# EAGLE design rs323-ttl-hack (EAGLE 8.2.2)
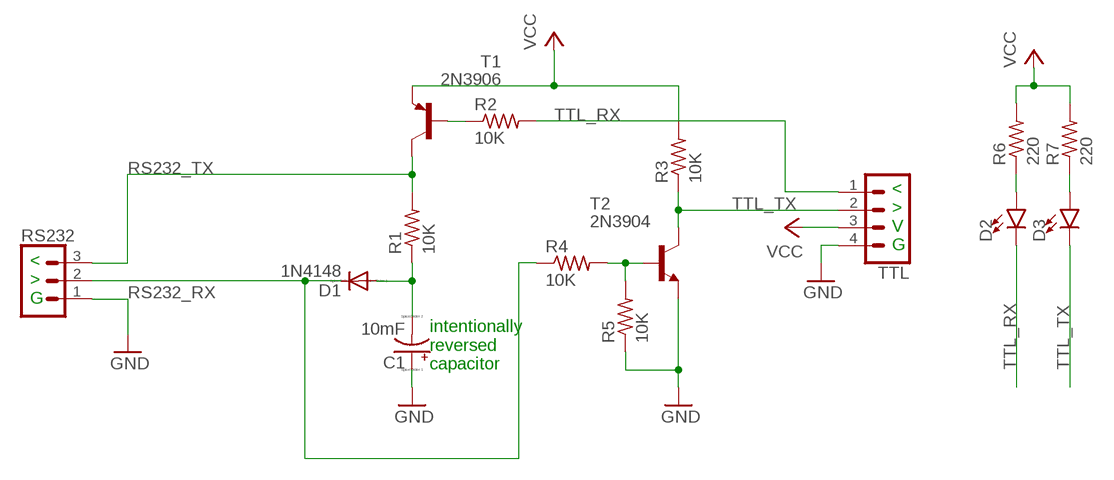
[diagram p0: schematic, sheet 1]

## Parts
C1  10mF  CPOL-USE2.5-6  [E2,5-6]
D1  1N4148  1N4148DO35-10  [DO35-10]
D2  LED3MM  [LED_3MM]
D3  LED3MM  [LED_3MM]
R1  10K  R-US_0207/10  [0207/10]
R2  10K  R-US_0207/10  [0207/10]
R3  10K  R-US_0207/10  [0207/10]
R4  10K  R-US_0207/10  [0207/10]
R5  10K  R-US_0207/10  [0207/10]
R6  220  R-US_0207/10  [0207/10]
R7  220  R-US_0207/10  [0207/10]
RS232  CONN_03  [1X03]
T1  2N3906  2N3906-PNP-TO92-EBC  [TO92-EBC]
T2  2N3904  2N3904-NPN-TO92-EBC  [TO92-EBC]
TTL  CONN_04  [1X04]

## Nets
GND: C1.+ R5.1 RS232.1 T2.E TTL.4
N$1: R2.1 T1.B
N$3: C1.- D1.A R1.1
N$5: D2.A R6.1
N$6: R4.2 R5.2 T2.B
N$7: D3.A R7.1
RS232_RX: D1.C R4.1 RS232.2
RS232_TX: R1.2 RS232.3 T1.C
TTL_RX: D2.K(C) R2.2 TTL.1
TTL_TX: D3.K(C) R3.1 T2.C TTL.2
VCC: R3.2 R6.2 R7.2 T1.E TTL.3

## Notes on the sheet
- <
  >
  V
  G
- <
  >
  G
- intentionally 
  reversed
  capacitor

## Library data of the parts
C1 = resistor:CPOL-US: POLARIZED CAPACITOR, American symbol
D1 = diode:1N4148: DIODE high speed (Philips)
D2 D3 = SparkFun-LED:LED: LED (Generic) Standard schematic elements and footprints for 5mm, 3mm, 1206, and 0603 sized LEDs. Generic LEDs with no color specified.; PROD_ID: DIO-08794
R1-R7 = resistor:R-US_: RESISTOR, American symbol
RS232 = SparkFun-Connectors:CONN_03: Multi connection point. Often used as Generic Header-pin footprint for 0.1 inch spaced/style header connections On any of the 0.1 inch spaced packages, you can populate with these: Break Away Headers - Straight <https://www.sparkfun.com/products/116> (PRT-00116) Break Away Male Headers - Right Angle <https://www.sparkfun.com/products/553> (PRT-00553) Female Headers <https://www.sparkfun.com/products/115> (PRT-00115) Break Away Headers - Machine Pin <https://www.sparkfun.com/products/117> (PRT-00117) Break Away Female Headers - Swiss Machine Pin <https://www.sparkfun.com/products/743> (PRT-00743) Stackable Header - 3 Pin (Female, 0.1") <https://www.sparkfun.com/products/13875> (PRT-13875) For SCREWTERMINALS and SPRING TERMINALS visit here: Screw Terimnals on SparkFun.com <https://www.sparkfun.com/search/results?term=Screw+Terminals> (5mm/3.5mm/2.54mm spacing) This device is also useful as a general connection point to wire up your design to another part of your project. Our various solder wires solder well into these plated through hole pads. Hook-Up Wire - Assortment (Stranded, 22 AWG) <https://www.sparkfun.com/products/11375> (PRT-11375) Hook-Up Wire - Assortment (Solid Core, 22 AWG) <https://www.sparkfun.com/products/11367> (PRT-11367) View the entire wire category on our website here <https://www.sparkfun.com/categories/141> Special notes: Molex polarized connector foot print use with SKU : PRT-08232 with associated crimp pins and housings.
T1 = transistor-neu-to92:*-PNP-: PNP Transistror
T2 = transistor-neu-to92:*-NPN-: NPN Transistror
TTL = SparkFun-Connectors:CONN_04: Multi connection point. Often used as Generic Header-pin footprint for 0.1 inch spaced/style header connections On any of the 0.1 inch spaced packages, you can populate with these: Break Away Headers - Straight <https://www.sparkfun.com/products/116> (PRT-00116) Break Away Male Headers - Right Angle <https://www.sparkfun.com/products/553> (PRT-00553) Female Headers <https://www.sparkfun.com/products/115> (PRT-00115) Break Away Headers - Machine Pin <https://www.sparkfun.com/products/117> (PRT-00117) Break Away Female Headers - Swiss Machine Pin <https://www.sparkfun.com/products/743> (PRT-00743) For SCREWTERMINALS and SPRING TERMINALS visit here: Screw Terimnals on SparkFun.com <https://www.sparkfun.com/search/results?term=Screw+Terminals> (5mm/3.5mm/2.54mm spacing) This device is also useful as a general connection point to wire up your design to another part of your project. Our various solder wires solder well into these plated through hole pads. Hook-Up Wire - Assortment (Stranded, 22 AWG) <https://www.sparkfun.com/products/11375> (PRT-11375) Hook-Up Wire - Assortment (Solid Core, 22 AWG) <https://www.sparkfun.com/products/11367> (PRT-11367) View the entire wire category on our website here <https://www.sparkfun.com/categories/141> Special notes: Molex polarized connector foot print use with SKU : PRT-08231 with associated crimp pins and housings. 1MM SMD Version SKU: PRT-10208; PROD_ID: CONN-09696

## Board
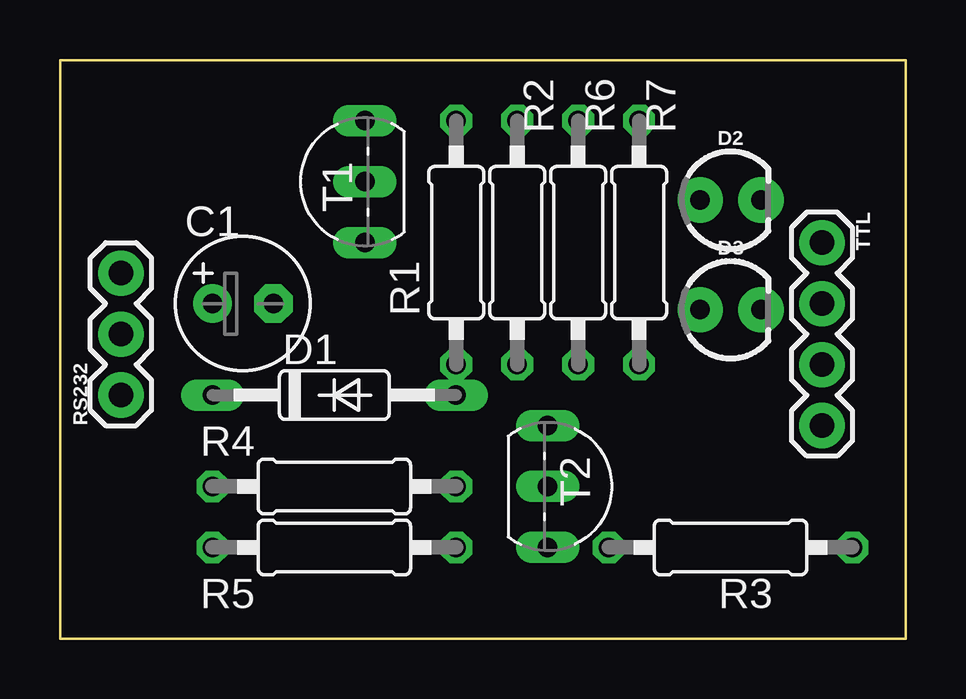
[diagram p1: board, top side]
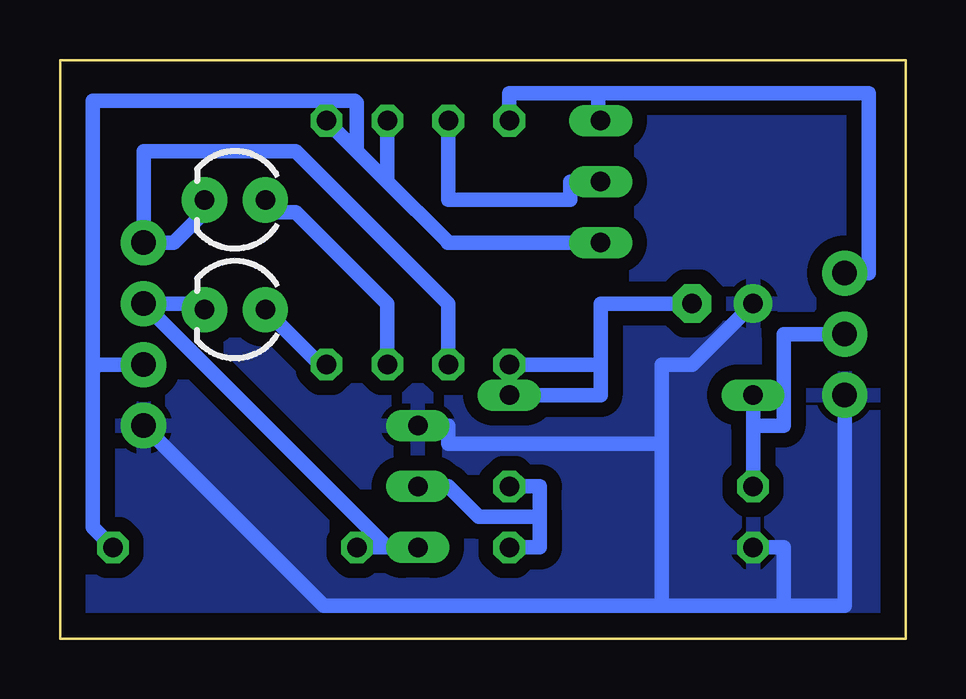
[diagram p2: board, bottom side, seen from below]

Size 35.23 x 24.12 mm. Coordinates in mm from the lower left corner, seen from the top.
Outline: 0,0 35.23,0 35.23,24.12 0,24.12 0,0
Copper layers (1*16): Top 0.035mm / dielectric 1.5mm / Bottom 0.035mm
Design rules "default": minimum track width 6mil, minimum drill 0.35mm, track to track 6mil, track to pad 6mil, pad to pad 6mil, via to via 6mil, smd to smd 6mil, copper to edge 40mil, drill to drill 6mil, minimum pad ring 10mil, minimum via ring 8mil, stop-mask expansion 4mil, vias tented up to drill 0mil, thermal gap 10mil

### Footprints (pad centres in the part's own frame; a part is rotated, then mirrored left to right if it is on the bottom)
E2,5-6 = drill 0.813 pad 1.6: + -1.27,0 | drill 0.813 pad 1.6 octagon: - 1.27,0
DO35-10 = drill 0.813 long: A 5.08,0; C -5.08,0
LED_3MM = drill 0.813 pad 1.88: A -1.27,0; K 1.27,0
0207/10 = drill 0.813 octagon: 1 -5.08,0; 2 5.08,0
1X03 = drill 1.016 pad 1.88: 1 0,0; 2 2.54,0; 3 5.08,0
TO92-EBC = drill 0.813 long: B 0,-1.27; C 2.54,-1.27; E -2.54,-1.27
1X04 = drill 1.016 pad 1.88: 1 0,0; 2 2.54,0; 3 5.08,0; 4 7.62,0

### Placement (x,y rotation side)
C1  7.62,13.97 0 top
D1  11.43,10.16 0 top
D2  27.94,18.29 0 top
D3  27.94,13.72 0 top
R1  16.51,16.51 90 top
R2  19.05,16.51 270 top
R3  27.94,3.81 0 top
R4  11.43,6.35 0 top
R5  11.43,3.81 0 top
R6  21.59,16.51 90 top
R7  24.13,16.51 90 top
RS232  2.54,10.16 90 top
T1  11.43,19.05 90 top
T2  21.59,6.35 270 top
TTL  31.75,16.51 270 top

### Tracks (layer width: path | path; a pad name or v marks a point on that pad's centre or on a via)
GND
  Bottom 0.61: RS232.1 2.54,1.37 5.11,1.37 | 5.11,1.37 10.17,1.37 | 10.17,1.37 24.23,1.37 TTL.4 | T2.E 19.05,8.89 19.05,8.13 10.16,8.13 | 10.16,8.13 10.16,1.38 10.17,1.37 | 10.16,8.13 10.16,11.43 8.89,11.43 C1.+ | R5.1 5.08,3.81 5.08,1.4 5.11,1.37
  pour Bottom (isolate 0.61): 0,24.13 35.56,24.13 35.56,0 0,0
N$1
  Bottom 0.61: T1.B 13.97,19.05 13.97,18.29 19.05,18.29 R2.1
N$3
  Bottom 0.61: 12.7,11.53 12.7,10.16 D1.A | R1.1 12.79,11.43 12.7,11.53 | C1.- 12.7,13.97 12.7,11.53
N$5
  Bottom 0.61: R6.1 21.59,13.97 25.4,17.78 26.16,17.78 D2.A
N$6
  Bottom 0.61: R4.2 15.24,6.35 15.24,5.23 | 15.24,5.23 15.24,3.81 R5.2 | T2.B 19.05,6.35 17.78,5.08 15.39,5.08 15.24,5.23
N$7
  Bottom 0.61: R7.1 24.38,11.43 D3.A
RS232_RX
  Bottom 0.61: 6.35,8.86 D1.C | 6.35,8.86 R4.1 | 6.35,8.86 6.32,8.89 5.08,8.89 5.08,12.7 RS232.2
RS232_TX
  Bottom 0.61: RS232.3 1.52,15.24 1.52,22.73 12.81,22.73 | R1.2 16.51,22.73 12.81,22.73 | 12.81,22.73 12.81,21.7 T1.C
TTL_RX
  Bottom 0.61: R2.2 19.05,13.97 25.4,20.32 31.75,20.32 TTL.1 30.48,16.51 29.21,17.78 D2.K
TTL_TX
  Bottom 0.61: T2.C 21.59,3.81 | 21.59,3.81 R3.1 | 21.59,3.81 TTL.2 29.21,13.97 D3.K
VCC
  Bottom 0.61: 33.86,11.22 33.86,4.65 R3.2 | 33.86,11.22 33.86,22.43 25.4,22.43 25,22.43 22.95,22.43 22.86,22.34 22.86,20.32 | TTL.3 33.65,11.43 33.86,11.22 | T1.E 19.08,16.51 19.08,16.54 21.67,19.13 | 22.86,20.32 21.67,19.13 | R6.2 21.59,19.21 21.67,19.13 | R7.2 22.86,20.32

### Text on the board
tDocu: TX_L | TTL | RX_L | < / > / G | < / > / V / G | RS232